# EAGLE design robot (EAGLE 6.1)

## Sheet 1 of 6
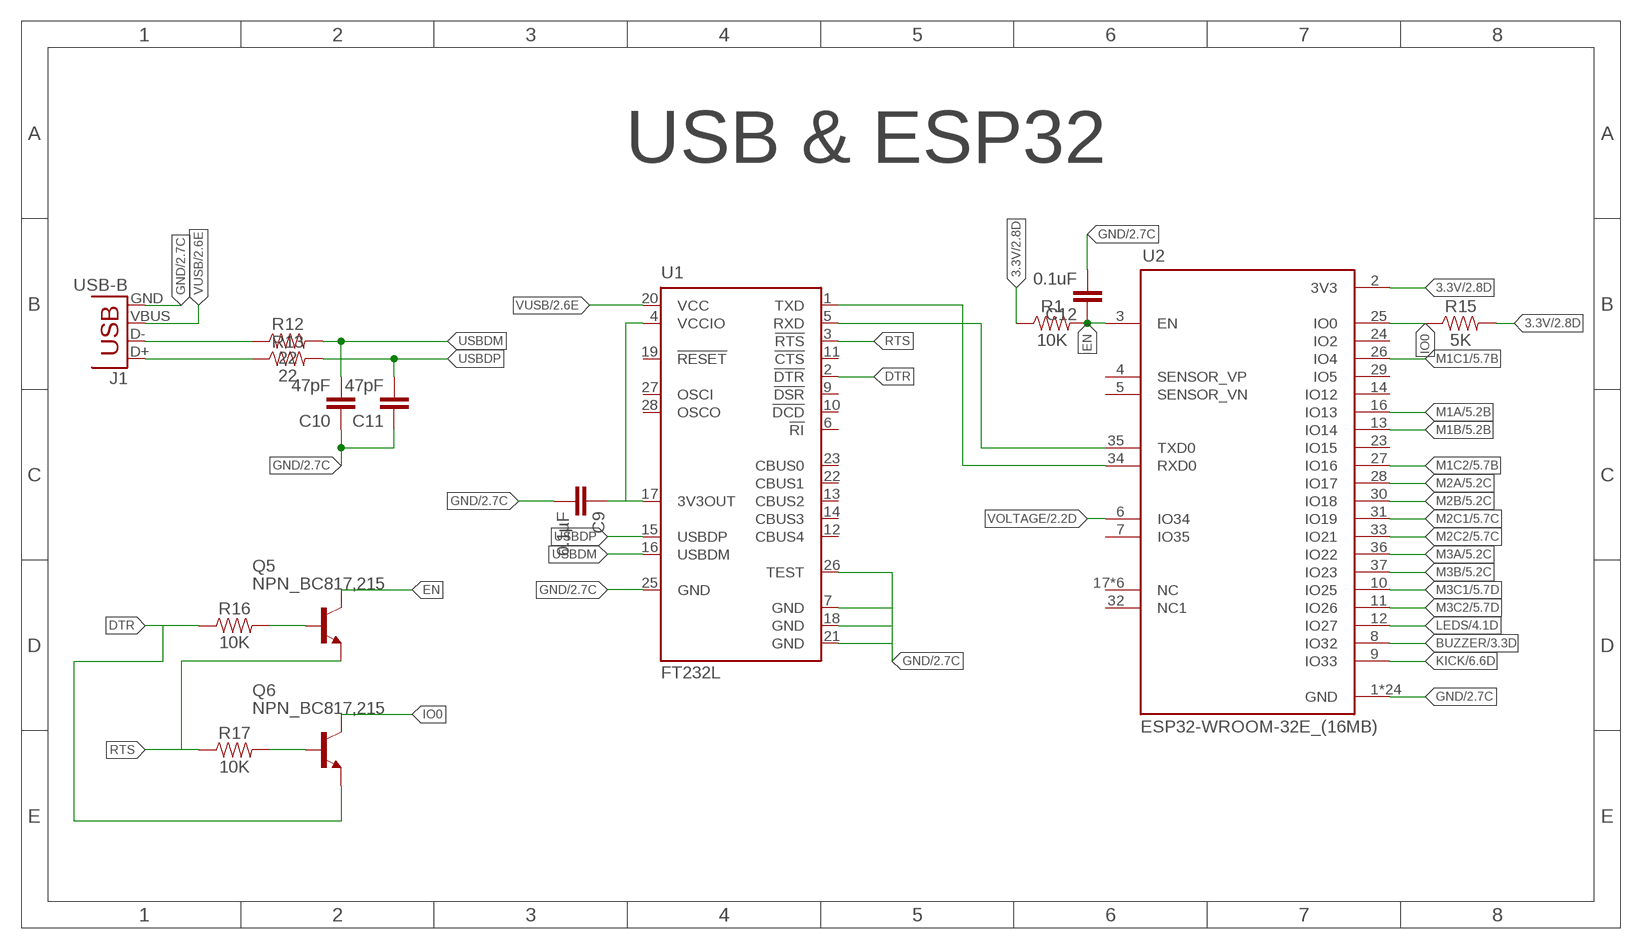
[diagram p0: schematic, sheet 1]

### Parts
C9  0.1µF  0.33UF/330NF-0805-50V-10%  [0805]
C10  47pF  CAP0805  [0805]
C11  47pF  CAP0805  [0805]
C12  0.1uF  CAP0805  [0805]
J1  USB-B  USBPTH  [USB-B-PTH]
Q5  NPN_BC817,215  [SOT-23]
Q6  NPN_BC817,215  [SOT-23]
R1  10K  0.3OHM-0805-1/8W-1%  [0805]
R12  22  0.3OHM-0805-1/8W-1%  [0805]
R13  22  0.3OHM-0805-1/8W-1%  [0805]
R15  5K  0.3OHM-0805-1/8W-1%  [0805]
R16  10K  0.3OHM-0805-1/8W-1%  [0805]
R17  10K  0.3OHM-0805-1/8W-1%  [0805]
U1  FT232L  [SSOP28]
U2  ESP32-WROOM-32E_(16MB)  [MODULE_ESP32-WROOM-32E_(16MB)]

### Nets
3.3V: R1.1 R15.2 U2.2(3V3) ; also sheet 2,3,5
BUZZER: U2.8(IO32) ; also sheet 3
DTR: Q6.2(E) R16.1 U1.2(!DTR)
EN: C12.1 Q5.3(C) R1.2 U2.3(EN)
GND [alime]: C9.2 C10.1 C11.1 C12.2 J1.GND U1.7(GND) U1.18(GND) U1.21(GND) U1.25(GND) U1.26(TEST) U2.1(GND) U2.15(GND) U2.38(GND) U2.39_1(GND) U2.39_2(GND) U2.39_3(GND) U2.39_4(GND) U2.39_5(GND) U2.39_6(GND) U2.39_7(GND) U2.39_8(GND) U2.39_9(GND) U2.39_10(GND) U2.39_11(GND) U2.39_12(GND) U2.39_13(GND) U2.39_14(GND) U2.39_15(GND) U2.39_16(GND) U2.39_17(GND) U2.39_18(GND) U2.39_19(GND) U2.39_20(GND) U2.39_21(GND) ; also sheet 2,3,4,5,6
IO0: Q6.3(C) R15.1 U2.25(IO0)
KICK: U2.9(IO33) ; also sheet 6
LEDS: U2.12(IO27) ; also sheet 4
M1A: U2.16(IO13) ; also sheet 5
M1B: U2.13(IO14) ; also sheet 5
M1C1: U2.26(IO4) ; also sheet 5
M1C2: U2.27(IO16) ; also sheet 5
M2A: U2.28(IO17) ; also sheet 5
M2B: U2.30(IO18) ; also sheet 5
M2C1: U2.31(IO19) ; also sheet 5
M2C2: U2.33(IO21) ; also sheet 5
M3A: U2.36(IO22) ; also sheet 5
M3B: U2.37(IO23) ; also sheet 5
M3C1: U2.10(IO25) ; also sheet 5
M3C2: U2.11(IO26) ; also sheet 5
N$6: U1.1(TXD) U2.34(RXD0)
N$14: U1.5(RXD) U2.35(TXD0)
N$15: C9.1 U1.4(VCCIO) U1.17(3V3OUT)
N$16: Q5.1(B) R16.2
N$17: Q6.1(B) R17.2
N$59: J1.D- R12.1
N$60: J1.D+ R13.1
RTS: Q5.2(E) R17.1 U1.3(!RTS)
USBDM: C10.2 R12.2 U1.16(USBDM)
USBDP: C11.2 R13.2 U1.15(USBDP)
VOLTAGE: U2.6(IO34) ; also sheet 2
VUSB [alime]: J1.VBUS U1.20(VCC) ; also sheet 2
Unconnected: U1.6(!RI) U1.9(!DSR) U1.10(!DCD) U1.11(!CTS) U1.12(CBUS4) U1.13(CBUS2) U1.14(CBUS3) U1.19(!RESET) U1.22(CBUS1) U1.23(CBUS0) U1.27(OSCI) U1.28(OSCO) U2.4(SENSOR_VP) U2.5(SENSOR_VN) U2.7(IO35) U2.14(IO12) U2.17(NC) U2.18(NC) U2.19(NC) U2.20(NC) U2.21(NC) U2.22(NC) U2.23(IO15) U2.24(IO2) U2.29(IO5) U2.32(NC1)

### Notes on the sheet
- USB & ESP32

## Sheet 2 of 6
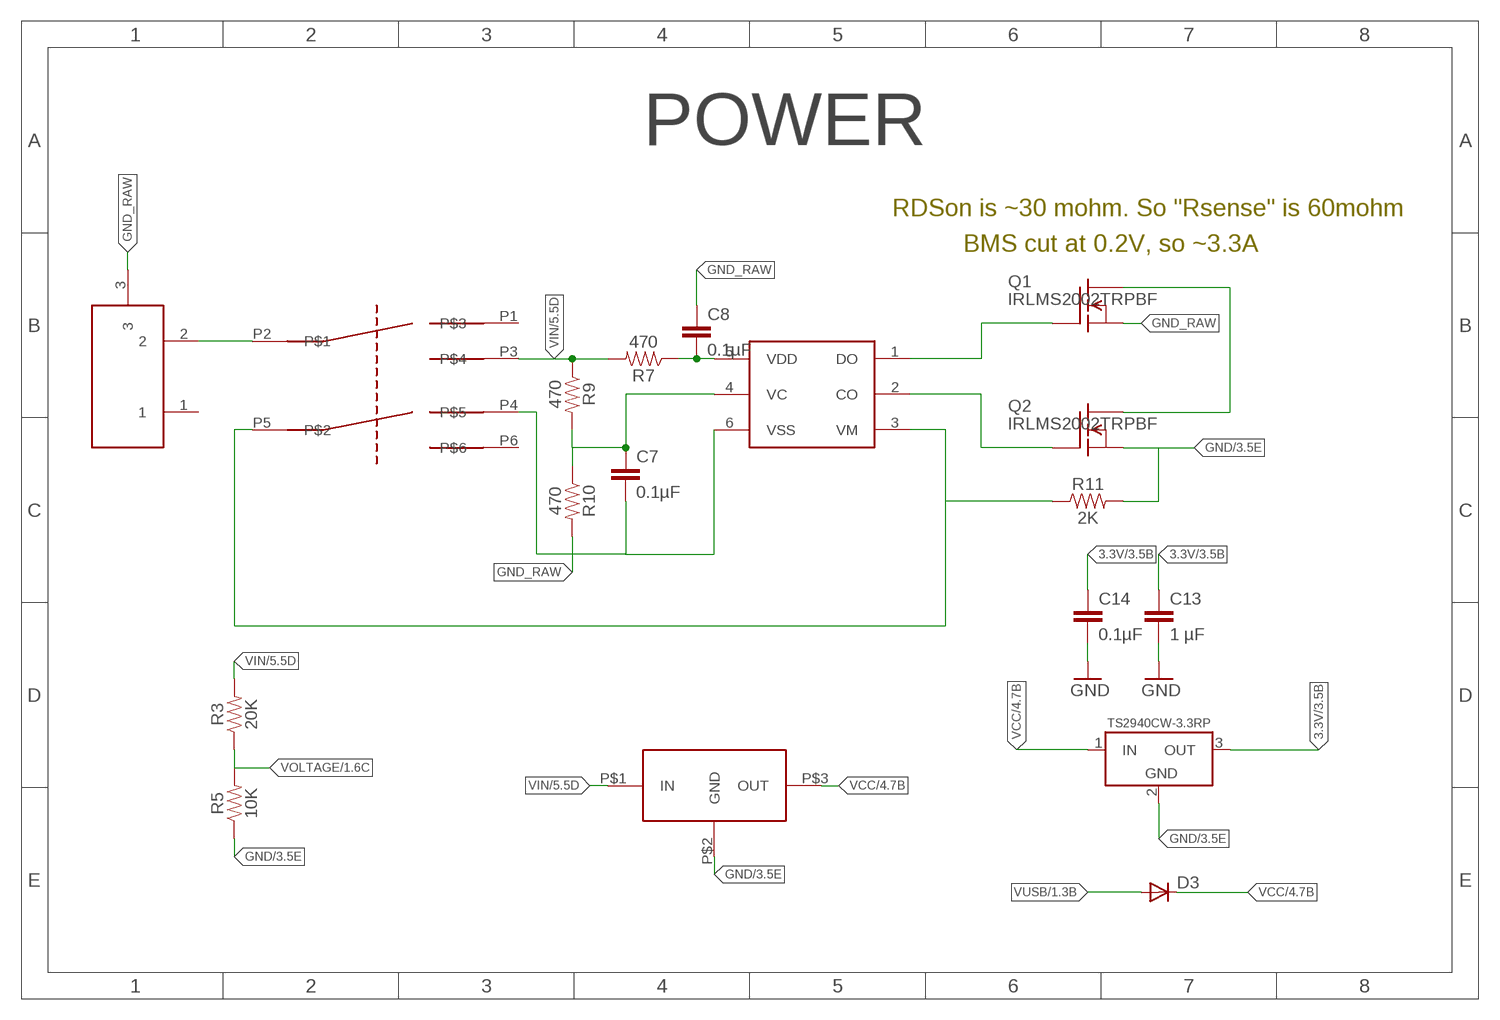
[diagram p1: schematic, sheet 2]

### Parts
C7  0.1µF  0.33UF/330NF-0805-50V-10%  [0805]
C8  0.1µF  0.33UF/330NF-0805-50V-10%  [0805]
C13  1 µF  0.33UF/330NF-0805-50V-10%  [0805]
C14  0.1µF  0.33UF/330NF-0805-50V-10%  [0805]
D3  DIODESOD  [SOD-323]
J2  DC21MMX  [DC-21MM]
Q1  IRLMS2002TRPBF  [SOT23-6]
Q2  IRLMS2002TRPBF  [SOT23-6]
R3  20K  0.3OHM-0805-1/8W-1%  [0805]
R5  10K  0.3OHM-0805-1/8W-1%  [0805]
R7  470  0.3OHM-0805-1/8W-1%  [0805]
R9  470  0.3OHM-0805-1/8W-1%  [0805]
R10  470  0.3OHM-0805-1/8W-1%  [0805]
R11  2K  0.3OHM-0805-1/8W-1%  [0805]
REG1  REG_5V  [TRACOPOWER]
S1  DPDT  [L202021MA04Q]
U3  S8252  [SOT23-6]
U$25  TS2940CW-3.3RP  [SOT223]

### Nets
3.3V: C13.1 C14.1 U$25.3(OUT) ; also sheet 1,3,5
GND [alime]: C13.2 C14.2 Q2.4(S) R5.1 R11.2 REG1.P$2(GND) U$25.2(GND) ; also sheet 1,3,4,5,6
GND_RAW [alime]: C7.2 C8.1 J2.3 Q1.4(S) R10.2 S1.P4 U3.6(VSS)
N$7 [alime]: J2.2 S1.P2
N$8: C8.2 R7.1 U3.5(VDD)
N$9: C7.1 R9.2 R10.1 U3.4(VC)
N$10: Q1.1(D) Q1.2(D) Q1.5(D) Q1.6(D) Q2.1(D) Q2.2(D) Q2.5(D) Q2.6(D)
N$11: Q2.3(G) U3.2(CO)
N$12: Q1.3(G) U3.1(DO)
N$13: R11.1 S1.P5 U3.3(VM)
VCC [alime]: D3.1(C) REG1.P$3(OUT) U$25.1(IN) ; also sheet 4
VIN [alime]: R3.2 R7.2 R9.1 REG1.P$1(IN) S1.P3 ; also sheet 5,6
VOLTAGE: R3.1 R5.2 ; also sheet 1
VUSB [alime]: D3.2(A) ; also sheet 1
Unconnected: S1.P1 S1.P6

### Notes on the sheet
- POWER
- RDSon is ~30 mohm. So "Rsense" is 60mohm
- BMS cut at 0.2V, so ~3.3A

## Sheet 3 of 6
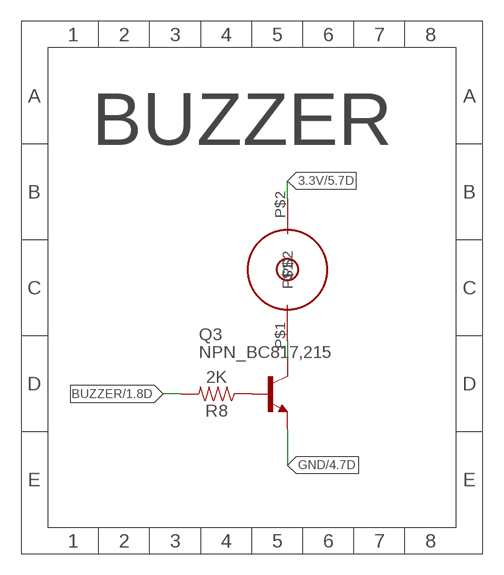
[diagram p2: schematic, sheet 3]

### Parts
B1  BUZZER66  [BUZZER66]
Q3  NPN_BC817,215  [SOT-23]
R8  2K  0.3OHM-0805-1/8W-1%  [0805]

### Nets
3.3V: B1.P$2 ; also sheet 1,2,5
BUZZER: R8.2 ; also sheet 1
GND [alime]: Q3.2(E) ; also sheet 1,2,4,5,6
N$3: Q3.1(B) R8.1
N$5: B1.P$1 Q3.3(C)

### Notes on the sheet
- BUZZER

## Sheet 4 of 6
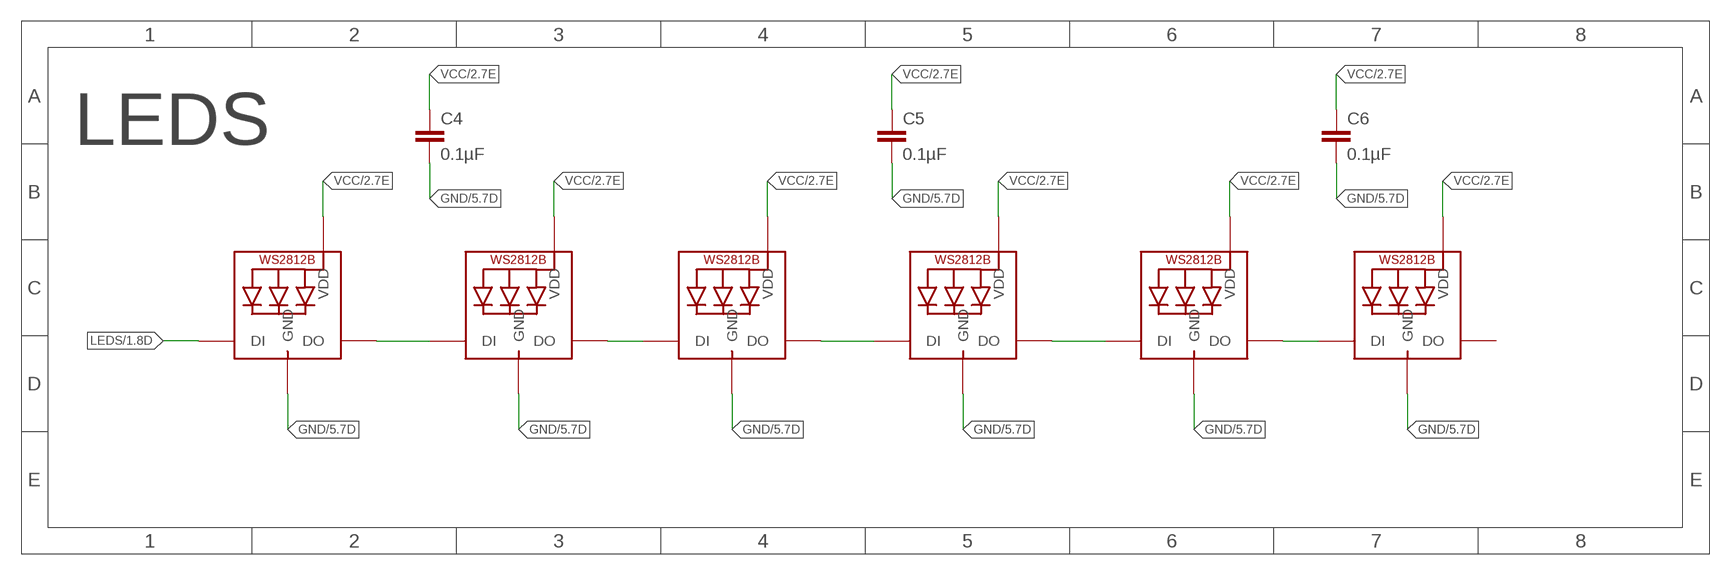
[diagram p3: schematic, sheet 4]

### Parts
C4  0.1µF  0.33UF/330NF-0805-50V-10%  [0805]
C5  0.1µF  0.33UF/330NF-0805-50V-10%  [0805]
C6  0.1µF  0.33UF/330NF-0805-50V-10%  [0805]
LED1  WS2812B5050  [WS2812B]
LED2  WS2812B5050  [WS2812B]
LED3  WS2812B5050  [WS2812B]
LED4  WS2812B5050  [WS2812B]
LED5  WS2812B5050  [WS2812B]
LED6  WS2812B5050  [WS2812B]

### Nets
GND [alime]: C4.2 C5.2 C6.2 LED1.3-GND(GND) LED2.3-GND(GND) LED3.3-GND(GND) LED4.3-GND(GND) LED5.3-GND(GND) LED6.3-GND(GND) ; also sheet 1,2,3,5,6
LEDS: LED1.4-DIN(DI) ; also sheet 1
N$27: LED1.2-DOUT(DO) LED2.4-DIN(DI)
N$28: LED2.2-DOUT(DO) LED3.4-DIN(DI)
N$30: LED4.2-DOUT(DO) LED5.4-DIN(DI)
N$32: LED5.2-DOUT(DO) LED6.4-DIN(DI)
N$39: LED3.2-DOUT(DO) LED4.4-DIN(DI)
VCC [alime]: C4.1 C5.1 C6.1 LED1.1-VDD(VDD) LED2.1-VDD(VDD) LED3.1-VDD(VDD) LED4.1-VDD(VDD) LED5.1-VDD(VDD) LED6.1-VDD(VDD) ; also sheet 2
Unconnected: LED6.2-DOUT(DO)

### Notes on the sheet
- LEDS

## Sheet 5 of 6
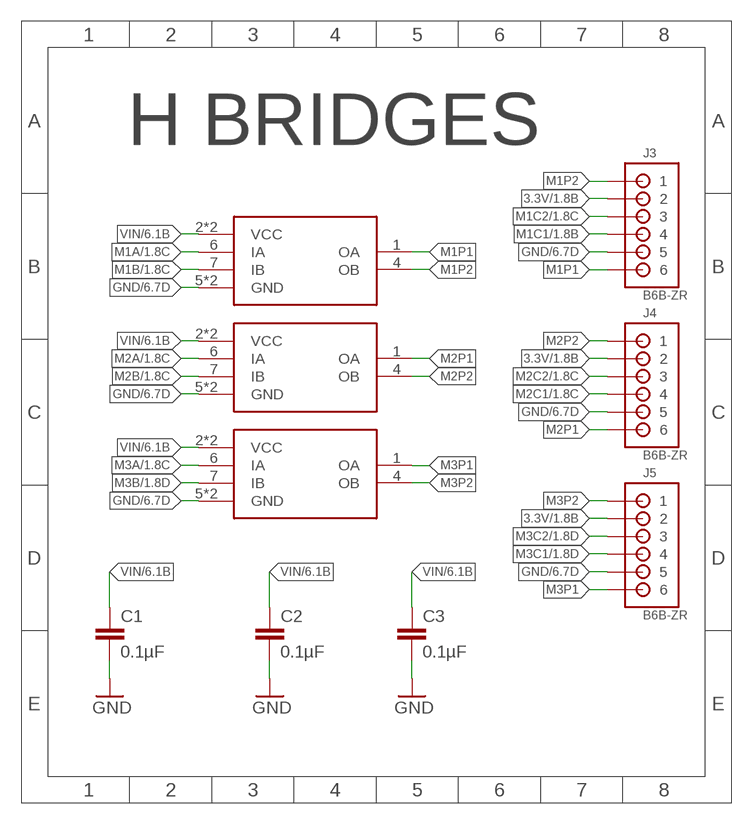
[diagram p4: schematic, sheet 5]

### Parts
C1  0.1µF  0.33UF/330NF-0805-50V-10%  [0805]
C2  0.1µF  0.33UF/330NF-0805-50V-10%  [0805]
C3  0.1µF  0.33UF/330NF-0805-50V-10%  [0805]
J3  B6B-ZR  [B6B-ZR]
J4  B6B-ZR  [B6B-ZR]
J5  B6B-ZR  [B6B-ZR]
U4  L9110  [SO8]
U5  L9110  [SO8]
U6  L9110  [SO8]

### Nets
3.3V: J3.2 J4.2 J5.2 ; also sheet 1,2,3
GND [alime]: C1.2 C2.2 C3.2 J3.5 J4.5 J5.5 U4.5(GND) U4.8(GND) U5.5(GND) U5.8(GND) U6.5(GND) U6.8(GND) ; also sheet 1,2,3,4,6
M1A: U4.6(IA) ; also sheet 1
M1B: U4.7(IB) ; also sheet 1
M1C1: J3.4 ; also sheet 1
M1C2: J3.3 ; also sheet 1
M1P1 [alime]: J3.6 U4.1(OA)
M1P2 [alime]: J3.1 U4.4(OB)
M2A: U5.6(IA) ; also sheet 1
M2B: U5.7(IB) ; also sheet 1
M2C1: J4.4 ; also sheet 1
M2C2: J4.3 ; also sheet 1
M2P1 [alime]: J4.6 U5.1(OA)
M2P2 [alime]: J4.1 U5.4(OB)
M3A: U6.6(IA) ; also sheet 1
M3B: U6.7(IB) ; also sheet 1
M3C1: J5.4 ; also sheet 1
M3C2: J5.3 ; also sheet 1
M3P1 [alime]: J5.6 U6.1(OA)
M3P2 [alime]: J5.1 U6.4(OB)
VIN [alime]: C1.1 C2.1 C3.1 U4.2(VCC) U4.3(VCC) U5.2(VCC) U5.3(VCC) U6.2(VCC) U6.3(VCC) ; also sheet 2,6

### Notes on the sheet
- H BRIDGES

## Sheet 6 of 6
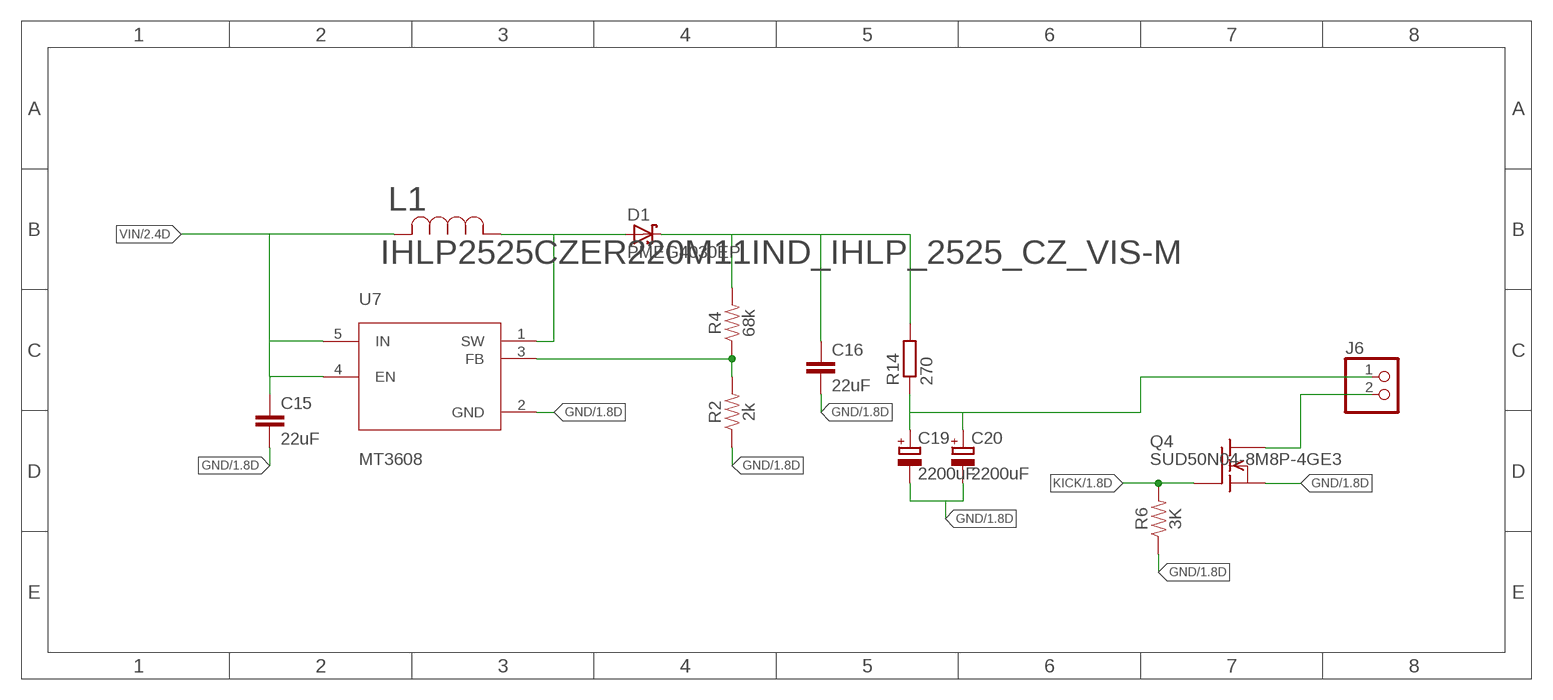
[diagram p5: schematic, sheet 6]

### Parts
C15  22uF  C-EUC0805  [C0805]
C16  22uF  C-EUC0805  [C0805]
C19  2200uF  CPOL-EUE5-13  [E5-13]
C20  2200uF  CPOL-EUE5-13  [E5-13]
D1  PMEG4030EP  [SOD128]
J6  KICKER  [KICKER]
L1  IHLP2525CZER220M11IND_IHLP_2525_CZ_VIS-M  [IND_IHLP_2525_CZ_VIS-M]
Q4  SUD50N04-8M8P-4GE3  [TO252]
R2  2k  0.3OHM-0805-1/8W-1%  [0805]
R4  68k  0.3OHM-0805-1/8W-1%  [0805]
R6  3K  0.3OHM-0805-1/8W-1%  [0805]
R14  270  R-EU_R2010  [R2010]
U7  MT3608  [SOT95P280X145-6N]

### Nets
GND [alime]: C15.2 C16.2 C19.- C20.- Q4.2(S) R2.1 R6.1 U7.2(GND) ; also sheet 1,2,3,4,5
KICK: Q4.1(G) R6.2 ; also sheet 1
KICKER: J6.2 Q4.3(D)
N$1: D1.2(A) L1.1 U7.1(SW)
N$2: C16.1 D1.1(K) R4.2 R14.2
N$4: R2.2 R4.1 U7.3(FB)
VIN [alime]: C15.1 L1.2 U7.4(EN) U7.5(IN) ; also sheet 2,5
VSTORE: C19.+ C20.+ J6.1 R14.1

## Power pins joined to a net without a drawn wire
1: J2.1

## Library data of the parts
B1 = rhoban:BUZZER; FARNELL: CEM-1203
C1-C9 C13 C14 = SparkFun-Capacitors:0.33UF/330NF: 0.33µF/330nF ceramic capacitors A capacitor is a passive two-terminal electrical component used to store electrical energy temporarily in an electric field.; FARNELL: 2688486RL; PROD_ID: CAP-08469; VALUE: 0.33µF
C10-C12 = SparkFun-Passives:CAP: Capacitor Standard 0603 ceramic capacitor, and 0.1" leaded capacitor.; FARNELL: 1081223
C15 C16 = resistor:C-EU: CAPACITOR, European symbol; FARNELL: 2666560
C19 C20 = rcl:CPOL-EU: POLARIZED CAPACITOR, European symbol; FARNELL: 2749341
D1 = nxp_60:PMEG4030E: 40 V, 3 A low VF MEGA Schottky barrier rectifier Planar Maximum Efficiency General Application (MEGA) Schottky barrier rectifier with an integrated guard ring for stress protection. AAL Eindhoven MK; FARNELL: 1829201
D3 = SparkFun-DiscreteSemi:DIODE: Diode These are standard reverse protection diodes and small signal diodes. SMA package can handle up to about 1A. SOD-323 can handle about 200mA. What the SOD-323 package when ordering, there are some mfgs out there that are 5-pin packages.; FARNELL: 8737843RL
J1 = SparkFun-Connectors:USB: USB Connectors USB-B-PTH is fully proven SKU : PRT-00139/CONN-08278 USB-miniB is fully proven SKU : PRT-00587 USB-A-PCB is untested. USB-A-H is throughly reviewed, but untested. Spark Fun Electronics SKU : PRT-00437 USB-B-SMT is throughly reviewed, but untested. Needs silkscreen touching up. USB-A-S has not been used/tested USB-MB-H has not been used/tested USB-MICROB has been used. CONN-09505; FARNELL: 1308876; PROD_ID: CONN-08278
J2 = powersupply:DC21MM; FARNELL: 1217037
J3-J5 = jst:B6B-ZR: JST-ZH Connector 6 pol, 1.5mm pitch Package: B6B-ZR Source: http://www.jst-mfg.com/product/pdf/eng/eZH.pdf; FARNELL: 9491805
J6 = rhoban:KICKER; FARNELL: JF-0530B
L1 = INDUCTOR:IHLP2525CZER220M11; BUILT_BY: EMA_UL_Team; FARNELL: 1741369; MANUFACTURER_PART_NUMBER: IHLP2525CZER220M11; SOURCELIBRARY: Vishay_2020-02-10; VENDOR: Vishay
LED1-LED6 = adafruit:WS2812B; FARNELL: WS2812B 5050
Q1 Q2 = rhoban:IRLMS2002TRPBF; FARNELL: 2577180RL
Q3 Q5 Q6 = rhoban:NPN; FARNELL: 1081223
Q4 = rhoban:SUD50N04-8M8P-4GE3; FARNELL: 1794799
R1 R12 R13 R15-R17 = SparkFun-Resistors:0.3OHM: 0.3Ω resistor A resistor is a passive two-terminal electrical component that implements electrical resistance as a circuit element. Resistors act to reduce current flow, and, at the same time, act to lower voltage levels within circuits. - Wikipedia; FARNELL: 2446926; PROD_ID: RES-11622; VALUE: 0.3
R2 R8 R11 = SparkFun-Resistors:0.3OHM: 0.3Ω resistor A resistor is a passive two-terminal electrical component that implements electrical resistance as a circuit element. Resistors act to reduce current flow, and, at the same time, act to lower voltage levels within circuits. - Wikipedia; FARNELL: 2447622; PROD_ID: RES-11622; VALUE: 0.3
R3 = SparkFun-Resistors:0.3OHM: 0.3Ω resistor A resistor is a passive two-terminal electrical component that implements electrical resistance as a circuit element. Resistors act to reduce current flow, and, at the same time, act to lower voltage levels within circuits. - Wikipedia; FARNELL: 2074395; PROD_ID: RES-11622; VALUE: 0.3
R4 = SparkFun-Resistors:0.3OHM: 0.3Ω resistor A resistor is a passive two-terminal electrical component that implements electrical resistance as a circuit element. Resistors act to reduce current flow, and, at the same time, act to lower voltage levels within circuits. - Wikipedia; FARNELL: 2447023; PROD_ID: RES-11622; VALUE: 0.3
R5 R9 R10 = SparkFun-Resistors:0.3OHM: 0.3Ω resistor A resistor is a passive two-terminal electrical component that implements electrical resistance as a circuit element. Resistors act to reduce current flow, and, at the same time, act to lower voltage levels within circuits. - Wikipedia; FARNELL: 2074334RL; PROD_ID: RES-11622; VALUE: 0.3
R6 = SparkFun-Resistors:0.3OHM: 0.3Ω resistor A resistor is a passive two-terminal electrical component that implements electrical resistance as a circuit element. Resistors act to reduce current flow, and, at the same time, act to lower voltage levels within circuits. - Wikipedia; FARNELL: 1887603; PROD_ID: RES-11622; VALUE: 0.3
R7 = SparkFun-Resistors:0.3OHM: 0.3Ω resistor A resistor is a passive two-terminal electrical component that implements electrical resistance as a circuit element. Resistors act to reduce current flow, and, at the same time, act to lower voltage levels within circuits. - Wikipedia; FARNELL: 2447662; PROD_ID: RES-11622; VALUE: 0.3
R14 = rcl:R-EU_: RESISTOR, European symbol; FARNELL: 1887603
REG1 = rhoban:REG_5V; FARNELL: 1696320
S1 = rhoban:DPDT; FARNELL: 2435159
U1 = rhoban:FT232: Source: http://www.ftdichip.com/Documents/DataSheets/DS_FT232R_v104.pdf; DATASHEET: ft232rl.pdf; FARNELL: 1146032; FARNELL_LINK: http://fr.farnell.com/ftdi/ft232rl/usb-vers-uart-cms-ssop28-232/dp/1146032?Ntt=1146032; MPN: FT232RL; OC_FARNELL: 1146032; OC_NEWARK: 91K9918
U2 = ESP32-WROOM-32E__16MB_:ESP32-WROOM-32E_(16MB): Bluetooth, WiFi 802.11b/g/n, Bluetooth v4.2 +EDR, Class 1, 2 and 3 Transceiver Module 2.4GHz ~ 2.5GHz Integrated, Trace Surface Mount Check availability; AVAILABILITY: In Stock; DESCRIPTION: Bluetooth, WiFi 802.11b/g/n, Bluetooth v4.2 +EDR, Class 1, 2 and 3 Transceiver Module 2.4GHz ~ 2.5GHz Integrated, Trace Surface Mount; FARNELL: ESP32-WROOM; MF: Espressif Systems; MP: ESP32-WROOM-32E (16MB); PACKAGE: SMD-44 Espressif Systems; PRICE: None
U3 = rhoban:S8252; FARNELL: https://www.digikey.fr/fr/products/detail/ablic-u-s-a-inc/S-8252AAL-M6T1U/6121452; REF: S-8252AAL-M6T1U
U4-U6 = rhoban:L9110; FARNELL: L9110 SOIC8
U7 = MT3608:MT3608: High Efficiency 1.2MHz 2A Step Up Converter Check prices; AVAILABILITY: No availability data; DESCRIPTION: High Efficiency 1.2MHz 2A Step Up Converter; FARNELL: MT3608; MF: Aerosemi Technology Co., Ltd; MP: MT3608; PACKAGE: Package; PRICE: None
U$25 = rhoban:TS2940CW-3.3RP; FARNELL: 7261403

## Net classes
0 default: width 0.203 mm
1 alime: width 0.508 mm
2 bigalime: width 0.381 mm

## Board
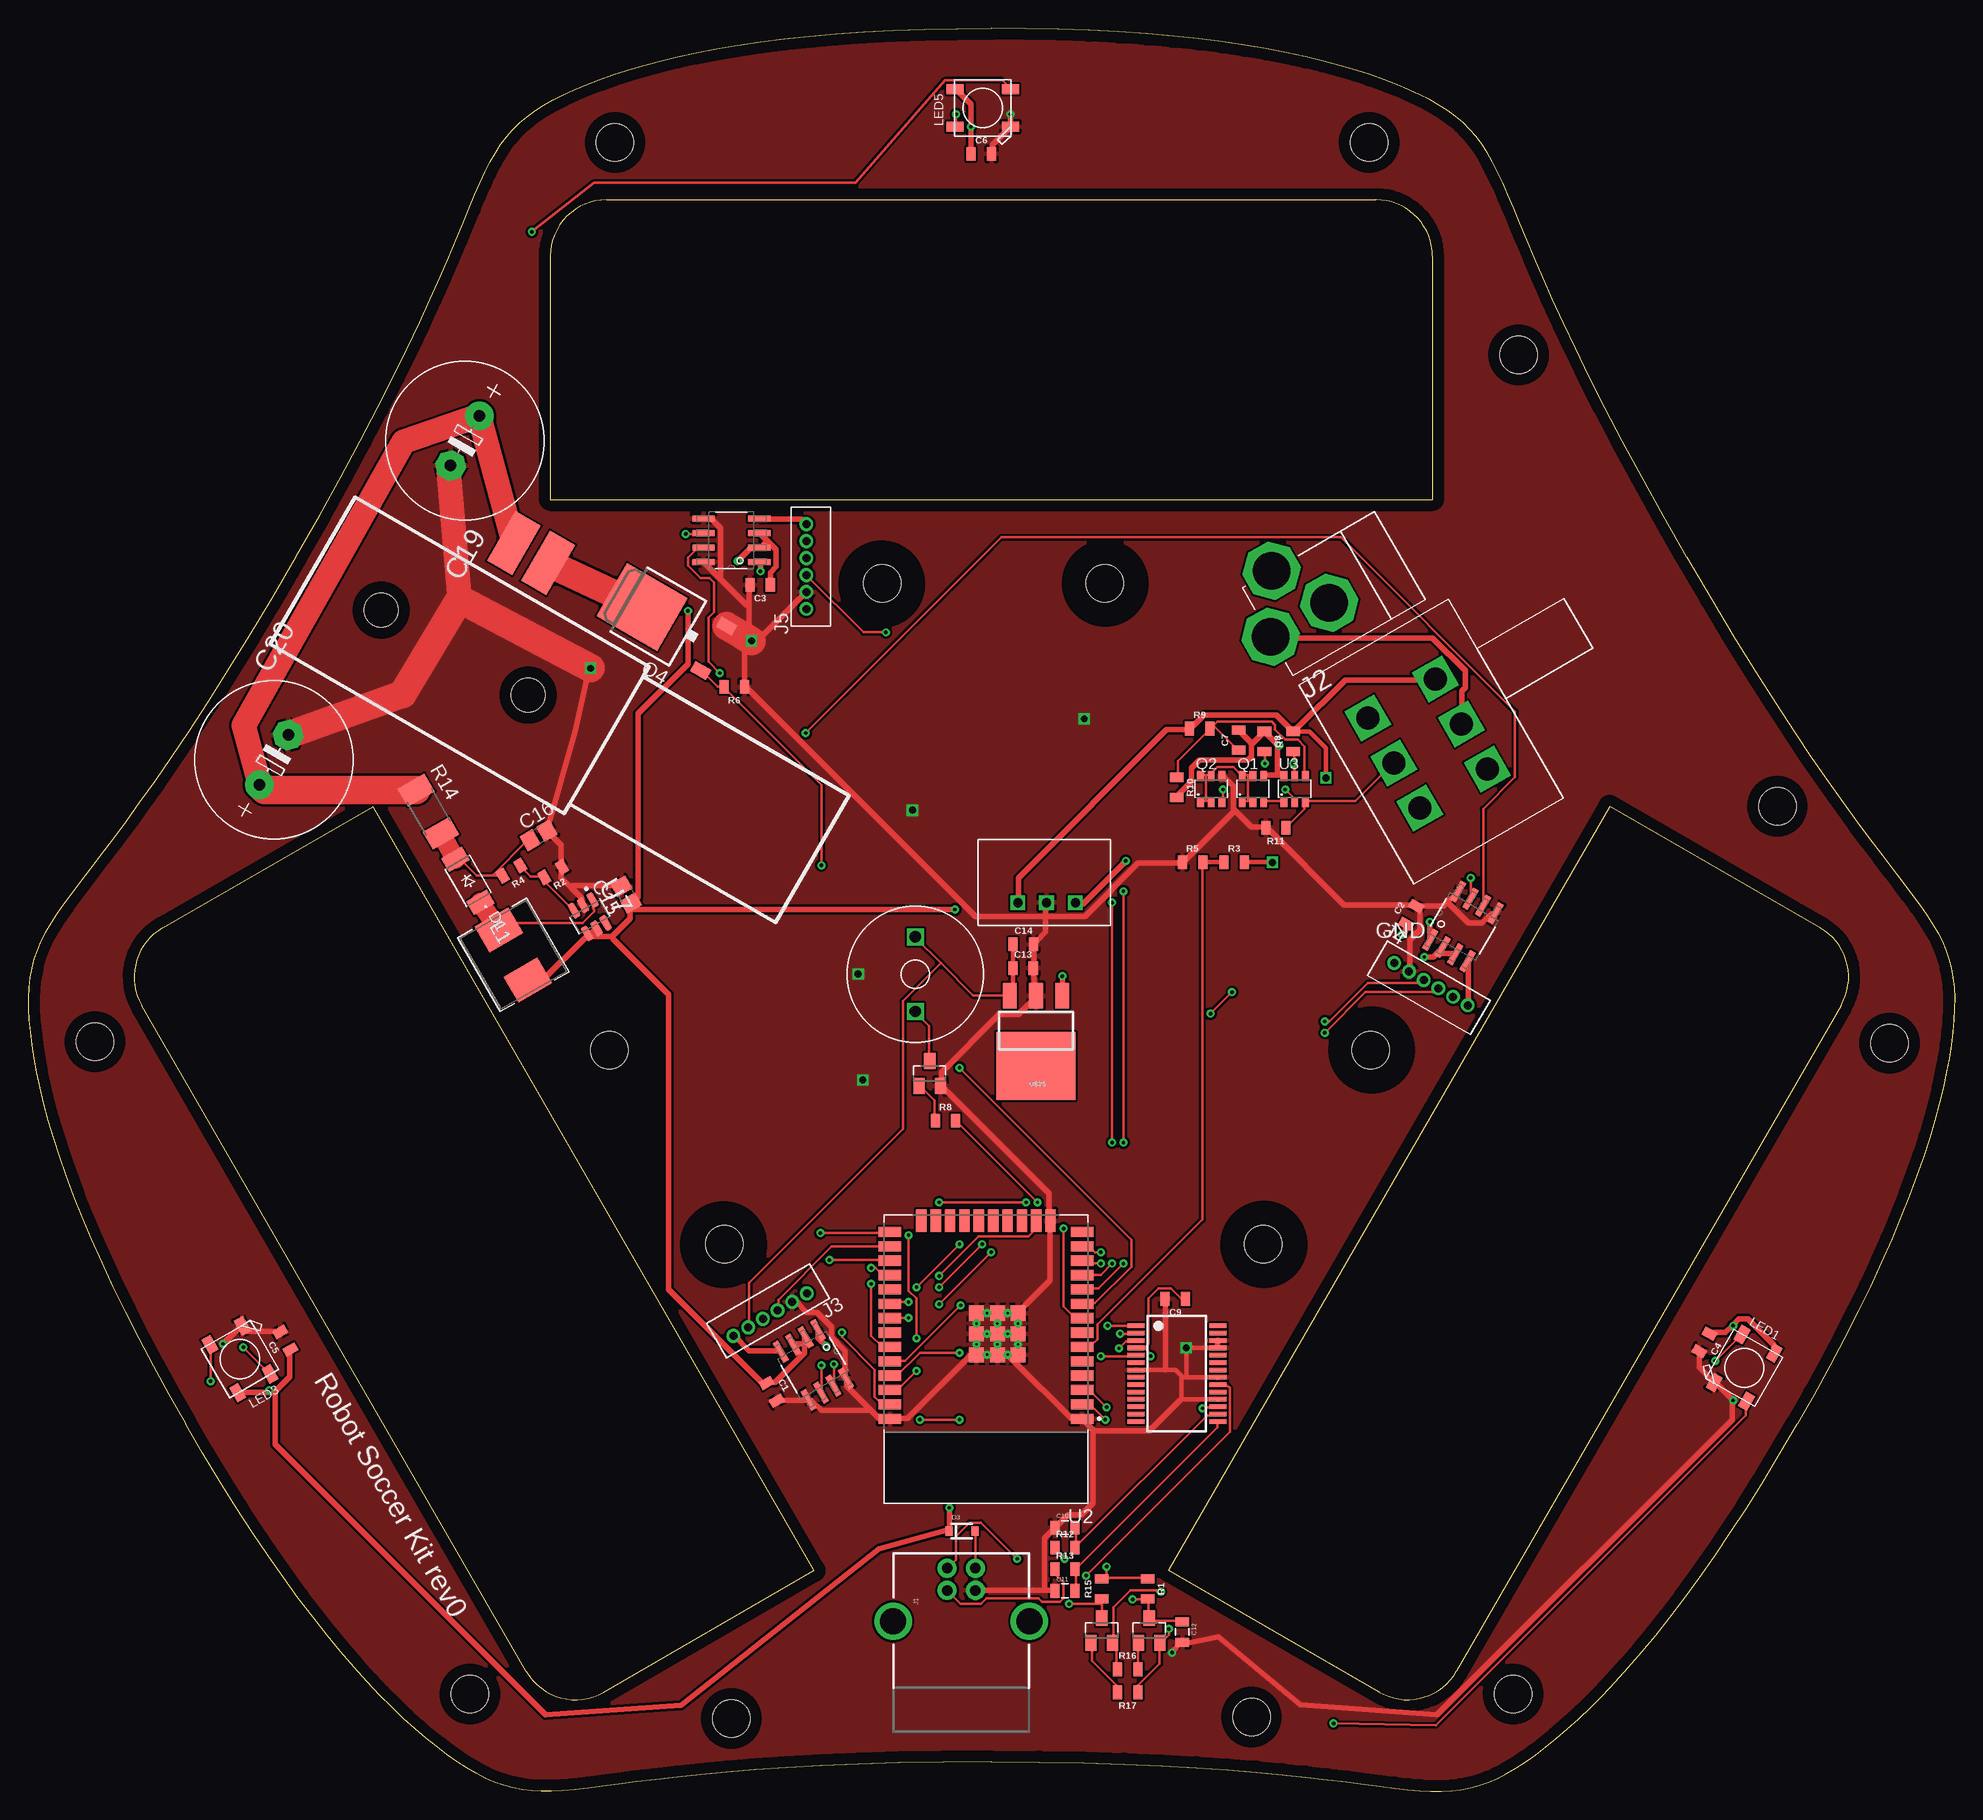
[diagram p6: board, top side]
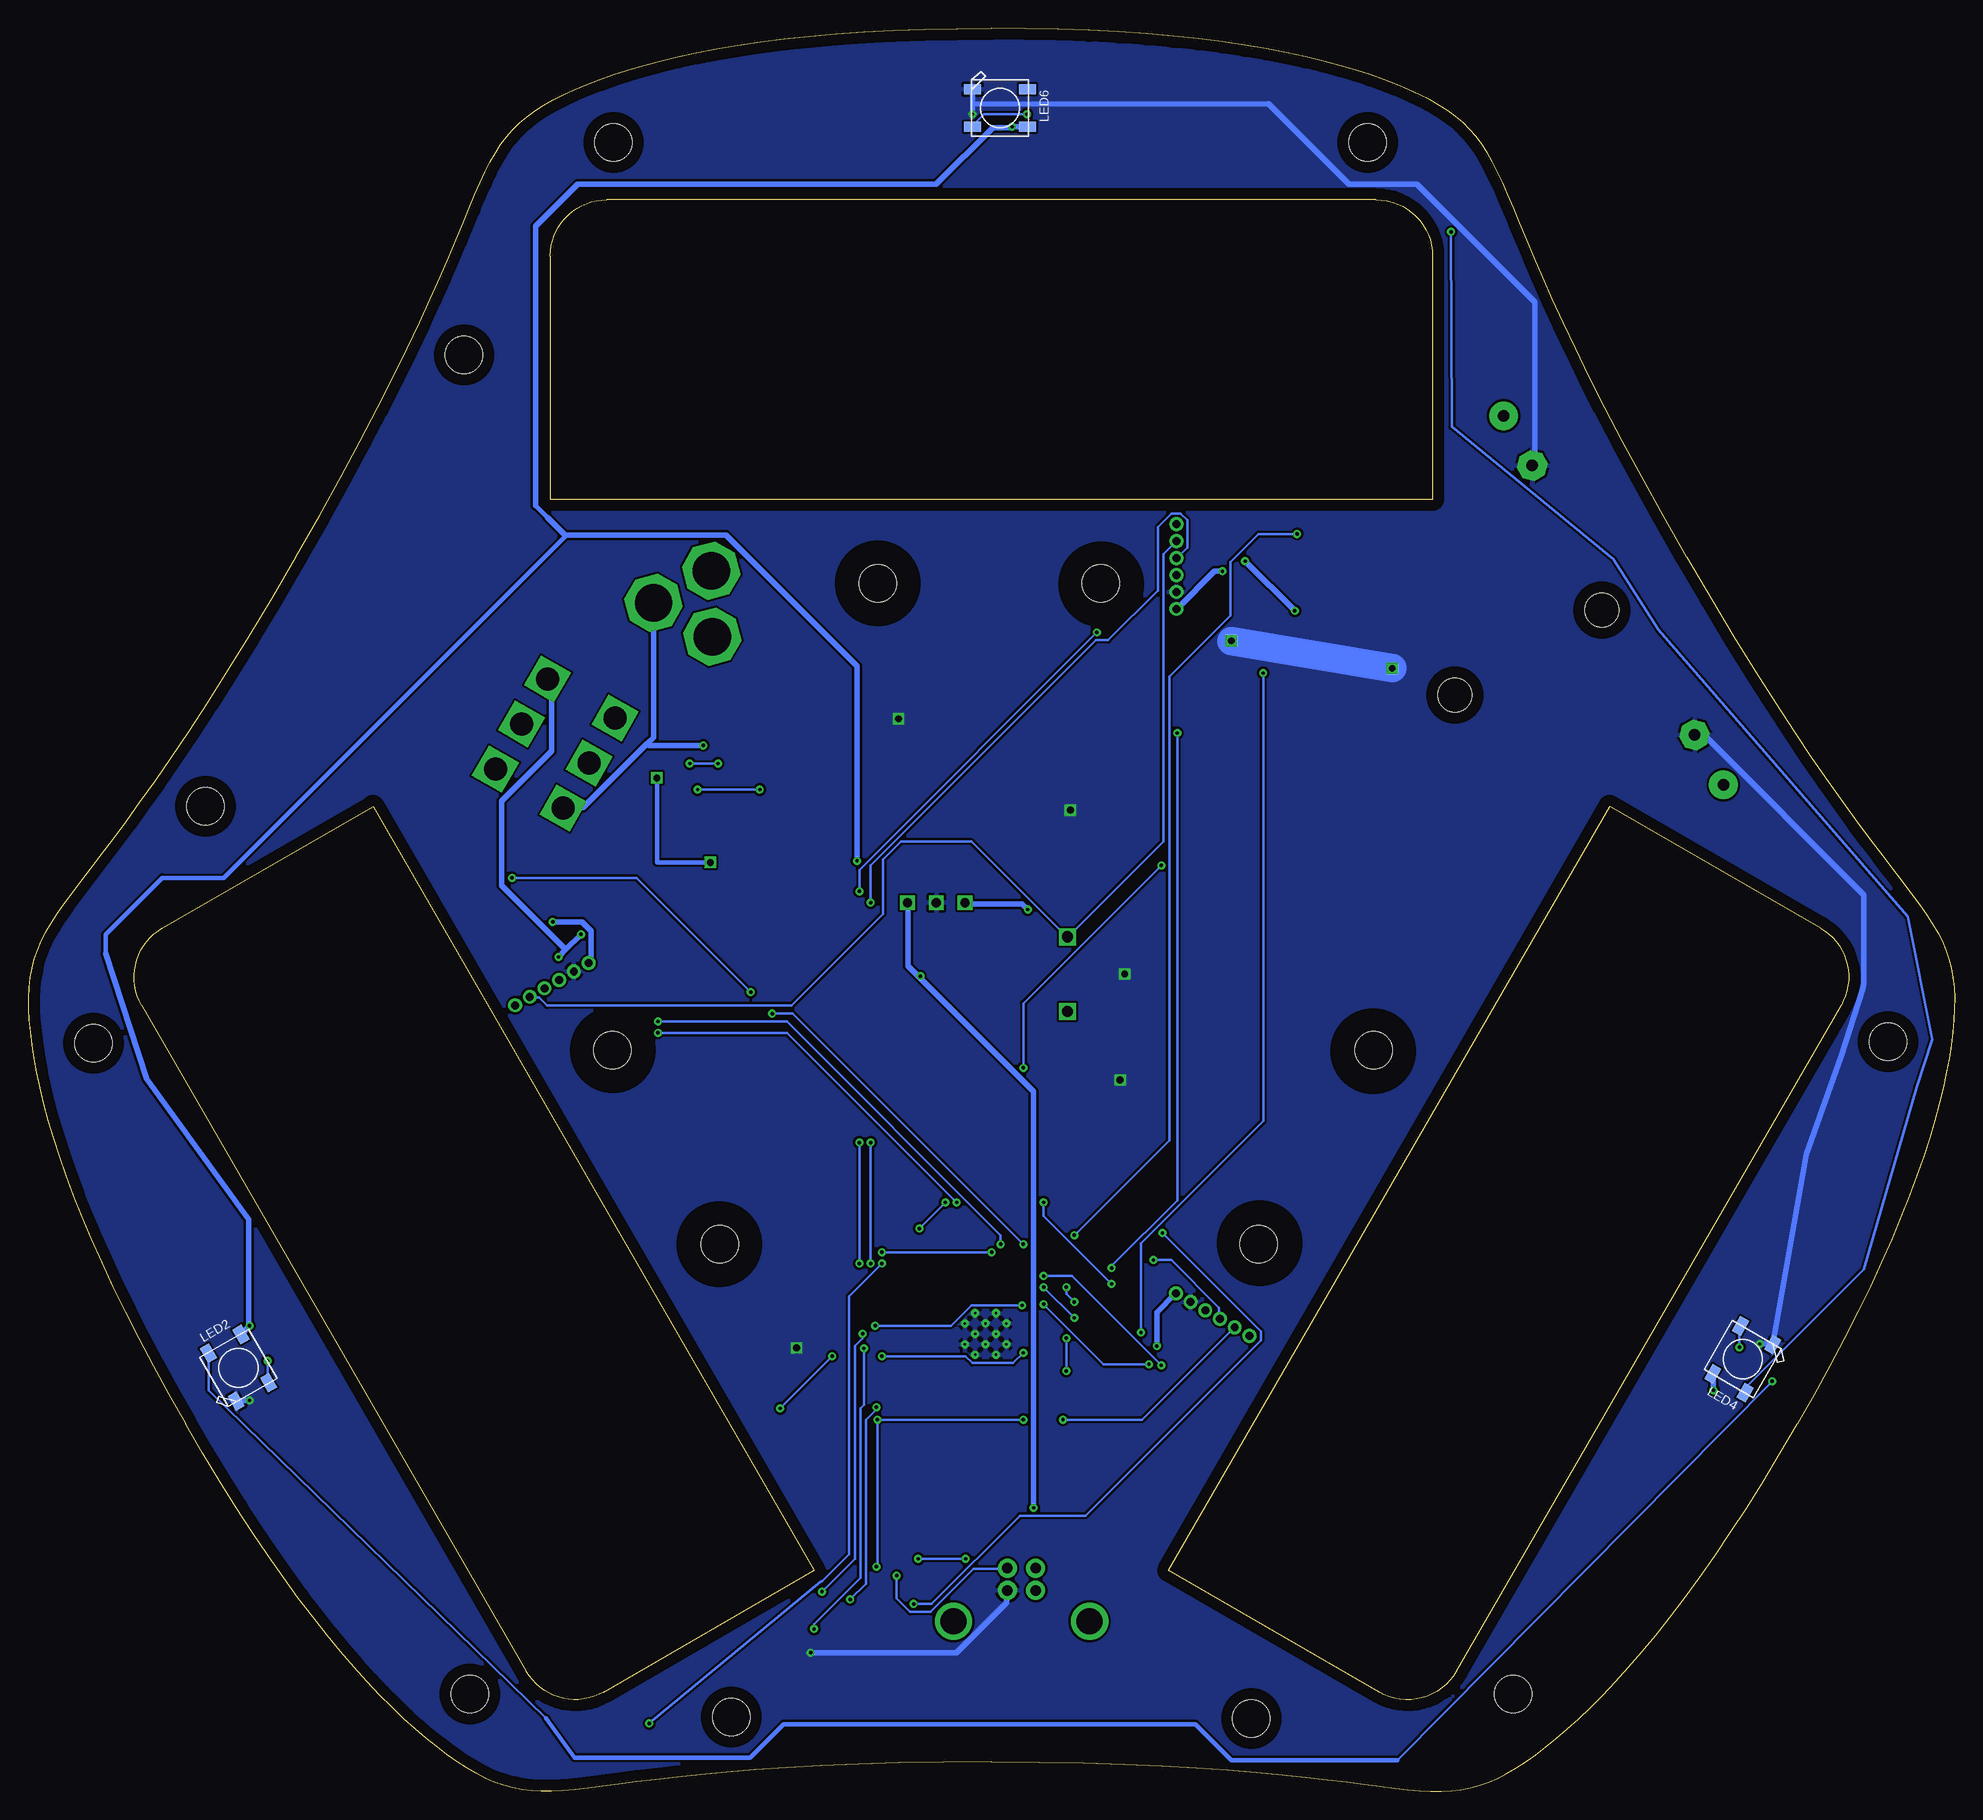
[diagram p7: board, bottom side, seen from below]

Size 170.28 x 155.86 mm. Coordinates in mm from the lower left corner, seen from the top.
Outline: 300 segments
Copper layers (1*16): Top 0.035mm / dielectric 1.5mm / Bottom 0.035mm
Design rules: minimum track width 6mil, minimum drill 0.3mm, track to track 0.205mm, track to pad 0.205mm, pad to pad 0.205mm, via to via 0.205mm, smd to smd 8mil, copper to edge 40mil, drill to drill 8mil, minimum pad ring 10mil, minimum via ring 8mil, stop-mask expansion 4mil, vias tented up to drill 25mil, thermal gap 10mil
tRestrict: area 47.6,61.6 to 55.2,69.2; area 57.6,44.5 to 65.3,52.2; area 114.9,61.7 to 122.6,69.4; area 105.4,44.5 to 113.1,52.2; area 71.6,102.9 to 79.3,110.6; area 91.4,103 to 99,110.6
bRestrict: area 47.6,61.6 to 55.2,69.2; area 57.7,44.7 to 65.2,52.2; area 114.8,61.8 to 122.4,69.3; area 105.4,44.6 to 113,52.1; area 71.6,102.9 to 79.2,110.5; area 91.4,103 to 98.9,110.6

### Footprints (pad centres in the part's own frame; a part is rotated, then mirrored left to right if it is on the bottom)
BUZZER66 = drill 1 square: P$1 -3.3,0; P$2 3.3,0
0805 = smd 0.8 x 1.2: 1 -0.9,0; 2 0.9,0
C0805 = smd 1.3 x 1.5: 1 -0.85,0; 2 0.85,0
E5-13 = drill 1.016 pad 2.54: + -2.54,0 | drill 1.016 pad 2.54 octagon: - 2.54,0
SOD128 = smd 1.4 x 2.1: 1 -2.2,0; 2 2.2,0
SOD-323 = smd 0.63 x 0.83: 1 -1.15,0; 2 1.15,0
USB-B-PTH = drill 0.914 pad 1.676: D+ 0,1.25; D- 1.981,1.25; GND 0,-1.25; VBUS 1.981,-1.25 | drill 2.286: S1 -2.718,-6.02; S2 -2.718,6.02
DC-21MM = drill 3.302 pad 4.826 octagon: 1 -5.08,-3.353; 2 -0.076,-6.35; 3 -0.076,-0.356
B6B-ZR = drill 0.7: 1 9,-1.3; 2 7.5,-1.3; 3 6,-1.3; 4 4.5,-1.3; 5 3,-1.3; 6 1.5,-1.3
KICKER = smd 2.54 x 5.08: 1 14.2,18.5; 2 17.7,18.5 | hole 3: 7,7.5; 22,7.5
IND_IHLP_2525_CZ_VIS-M = smd 2.625 x 3.429: 1 -2.557,0; 2 2.557,0
WS2812B = smd 1.5 x 0.9: 1-VDD 2.45,-1.65; 2-DOUT 2.45,1.65; 3-GND -2.45,1.65; 4-DIN -2.45,-1.65
SOT23-6 = smd 0.6 x 0.9: 1 -0.95,-1.15; 2 0,-1.15; 3 0.95,-1.15; 4 0.95,1.15; 5 0,1.15; 6 -0.95,1.15
SOT-23 = smd 1 x 1.4: 1 -0.95,-1.1; 2 0.95,-1.1; 3 0,1.1
TO252 = smd 1 x 1.6: 1 -2.28,-4.8; 2 2.28,-4.8 | smd 5.4 x 6.2: 3 0,2.5
R2010 = smd 1.8 x 2.7: 1 -2.2,0; 2 2.2,0
TRACOPOWER = drill 0.8 square: P$1 3.5,2; P$2 6.04,2; P$3 8.58,2
L202021MA04Q = drill 2.032 square: P1 6.909,-4.597; P2 6.909,0; P3 6.909,4.597; P4 0,-4.597; P5 0,0; P6 0,4.597
SSOP28 = smd 0.4 x 1.5: 1 -4.225,-3.625; 2 -3.575,-3.625; 3 -2.925,-3.625; 4 -2.275,-3.625; 5 -1.625,-3.625; 6 -0.975,-3.625; 7 -0.325,-3.625; 8 0.325,-3.625; 9 0.975,-3.625; 10 1.625,-3.625; 11 2.275,-3.625; 12 2.925,-3.625; 13 3.575,-3.625; 14 4.225,-3.625; 15 4.225,3.625; 16 3.575,3.625; 17 2.925,3.625; 18 2.275,3.625; 19 1.625,3.625; 20 0.975,3.625; 21 0.325,3.625; 22 -0.325,3.625; 23 -0.975,3.625; 24 -1.625,3.625; 25 -2.275,3.625; 26 -2.925,3.625; 27 -3.575,3.625; 28 -4.225,3.625
MODULE_ESP32-WROOM-32E_(16MB) = smd 2 x 0.9: 1 -8.5,5.26; 2 -8.5,3.99; 3 -8.5,2.72; 4 -8.5,1.45; 5 -8.5,0.18; 6 -8.5,-1.09; 7 -8.5,-2.36; 8 -8.5,-3.63; 9 -8.5,-4.9; 10 -8.5,-6.17; 11 -8.5,-7.44; 12 -8.5,-8.71; 13 -8.5,-9.98; 14 -8.5,-11.25; 25 8.5,-11.25; 26 8.5,-9.98; 27 8.5,-8.71; 28 8.5,-7.44; 29 8.5,-6.17; 30 8.5,-4.9; 31 8.5,-3.63; 32 8.5,-2.36; 33 8.5,-1.09; 34 8.5,0.18; 35 8.5,1.45; 36 8.5,2.72; 37 8.5,3.99; 38 8.5,5.26 | smd 0.9 x 2: 15 -5.715,-12.25; 16 -4.445,-12.25; 17 -3.175,-12.25; 18 -1.905,-12.25; 19 -0.635,-12.25; 20 0.635,-12.25; 21 1.905,-12.25; 22 3.175,-12.25; 23 4.445,-12.25; 24 5.715,-12.25 | smd 1.33 x 1.33: 39_1 -2.835,-0.405; 39_2 -1,-0.405; 39_3 0.835,-0.405; 39_4 -2.835,-2.24; 39_5 -1,-2.24; 39_6 0.835,-2.24; 39_7 -2.835,-4.075; 39_8 -1,-4.075; 39_9 0.835,-4.075 | drill 0.2 pad 0.3: 39_10 -1.917,-0.405; 39_11 -0.083,-0.405; 39_12 -2.835,-1.323; 39_13 -1,-1.323; 39_14 0.835,-1.323; 39_15 -1.917,-2.24; 39_16 -0.083,-2.24; 39_17 -2.835,-3.158; 39_18 -1,-3.158; 39_19 0.835,-3.158; 39_20 -1.917,-4.075; 39_21 -0.083,-4.075
SO8 = smd 1.981 x 0.533: 1 -2.464,1.905; 2 -2.464,0.635; 3 -2.464,-0.635; 4 -2.464,-1.905; 5 2.464,-1.905; 6 2.464,-0.635; 7 2.464,0.635; 8 2.464,1.905
SOT95P280X145-6N = smd 1.37 x 0.59: 1 -1.17,0.95; 2 -1.17,0; 3 -1.17,-0.95; 4 1.17,-0.95; 5 1.17,0; 6 1.17,0.95
STAND-OFF = hole 3.302: 0,0
SOT223 = smd 1.219 x 2.235: 1 -2.311,-3.099; 2 0,-3.099; 3 2.311,-3.099 | smd 7 x 6: 4 0,3.099

### Placement (x,y rotation side)
B1  78.41,72.24 90 top
C1  65.72,35.32 300 top
C2  122.24,77.47 60 top
C3  64.7,106.66 180 top
C4  148.16,39.68 240 top
C5  22.72,39.84 120 top
C6  84.25,144.76 0 top
C7  106.99,92.94 90 top
C8  109.27,92.81 270 top
C9  101.4,43.54 180 top
C10  91.65,23.32 0 top
C11  91.65,17.73 0 top
C12  102.01,14.1 270 top
C13  87.94,72.77 0 top
C14  87.96,74.88 0 top
C15  52.86,79.27 120 top
C16  45.11,84.51 30 top
C19  38.6,119.41 240 top
C20  21.71,91.19 60 top
D1  38.86,80.49 300 top
D3  82.53,23.01 0 top
J1  82.48,17.76 90 top
J2  115.36,105.18 300 top
J3  70.78,43.65 210 top
J4  120.11,75.11 330 top
J5  67.49,103.03 90 top
J6  21.38,101.43 330 top
L1  42.89,73.95 300 top
LED1  151.69,37.44 60 top
LED2  151.69,37.44 120 bottom
LED3  18.72,38.2 300 top
LED4  18.72,38.2 240 bottom
LED5  84.38,148.82 180 top
LED6  84.38,148.82 0 bottom
Q1  108.26,88.62 0 top
Q2  104.57,88.62 0 top
Q3  79.68,63.48 0 top
Q4  56.43,103.45 60 top
Q5  99.09,14.22 0 top
Q6  94.9,14.22 0 top
R1  98.96,17.91 270 top
R2  46.4,81.27 210 top
R3  106.61,82.14 0 top
R4  42.71,81.39 210 top
R5  102.92,82.14 0 top
R6  62.41,97.64 180 top
R7  111.81,92.81 90 top
R8  81.08,59.28 0 top
R9  103.56,93.96 0 top
R10  101.53,88.75 270 top
R11  110.29,85.19 180 top
R12  91.65,21.54 0 top
R13  91.65,19.63 0 top
R14  35.39,86.61 300 top
R15  94.9,17.91 90 top
R16  97.18,10.8 0 top
R17  97.18,8.76 180 top
REG1  83.97,76.56 0 top
S1  120.7,90.91 30 top
U1  101.53,36.93 270 top
U2  84.66,38.2 180 top
U3  111.94,88.62 0 top
U4  69.39,37.69 300 top
U5  126.81,76.46 60 top
U6  62.16,110.59 180 top
U7  49.64,77.32 300 top
U$2  [STAND-OFF]  39.04,8.61 45 top
U$3  [STAND-OFF]  62.16,6.45 45 top
U$4  [STAND-OFF]  108.13,6.58 45 top
U$5  [STAND-OFF]  131.24,8.61 45 top
U$6  [STAND-OFF]  164.52,66.14 45 top
U$8  [STAND-OFF]  154.61,87.1 45 top
U$9  [STAND-OFF]  131.75,126.98 45 top
U$10  [STAND-OFF]  118.54,145.77 45 top
U$11  [STAND-OFF]  51.87,145.77 45 top
U$15  [STAND-OFF]  5.89,66.27 45 top
U$25  89.08,67.23 180 top
U$31  [STAND-OFF]  51.36,65.51 45 top
U$33  [STAND-OFF]  61.52,48.36 45 top
U$35  [STAND-OFF]  118.67,65.51 45 top
U$36  [STAND-OFF]  109.15,48.36 45 top
U$38  [STAND-OFF]  75.49,106.78 45 top
U$39  [STAND-OFF]  95.18,106.78 45 top

### Tracks (layer width: path | path; a pad name or v marks a point on that pad's centre or on a via)
3.3V  (via drill 0.3)
  Top 0.203: R1.1 98.92,18.86 94.92,18.86 R15.2 95.32,18.96 v95.32,19.86 | v95.22,32.86 93.92,34.16 93.22,34.16 U2.2 | 80.67,73.21 78.42,75.46 B1.P$2 | 80.67,73.21 83.52,70.36 86.72,70.36 U$25.3 | 80.67,73.21 77.32,69.86 77.32,58.56 63.72,44.96 63.72,41.06 J3.2 | v78.82,32.86 v82.32,32.86
  Top 0.406: 86.72,70.36 87.04,70.36 C13.1 87.06,72.77 C14.1
  Bottom 0.203: v95.32,19.86 95.22,19.96 v95.22,32.86 v82.32,32.86 | J5.2 68.82,110.46 69.92,109.36 69.92,83.96 78.32,75.56 B1.P$2 78.52,75.56 86.92,83.96 93.12,83.96 94.72,82.36 94.72,77.56 102.82,69.46 124.42,69.46 125.12,70.16 125.92,70.16 J4.2 | v78.82,32.86 71.82,32.86 63.72,40.96 J3.2
BUZZER  (via drill 0.3)
  Top 0.203: v89.22,52.06 82.02,59.26 R8.2 | v91.52,49.76 91.52,42.86 92.52,41.86 93.12,41.86 U2.8
  Bottom 0.203: v91.52,49.76 v89.22,52.06
DTR  (via drill 0.3)
  Top 0.203: R16.1 96.22,10.86 96.22,12.76 95.92,13.06 Q6.2 95.92,13.16 95.92,16.26 97.42,17.76 99.72,17.76 99.82,17.66 v100.12,17.66 | v96.52,40.46 97.82,40.46 U1.2
  Bottom 0.203: v96.52,40.46 96.52,40.06 97.22,39.36 97.22,20.56 v100.12,17.66
EN  (via drill 0.3)
  Top 0.203: C12.1 101.92,15.06 99.32,15.06 99.12,15.26 Q5.3 99.02,15.36 99.02,16.96 R1.2 98.92,16.96 v97.62,16.96 | v95.32,33.96 93.82,35.46 93.22,35.46 U2.3
  Bottom 0.203: v95.32,33.96 95.32,33.76 96.22,32.86 96.22,18.36 v97.62,16.96
GND  (via drill 0.3, 0.6)
  Top 0.406: U1.7 100.52,37.26 101.4,37.26 101.94,36.72 | 101.94,36.72 102.05,36.61 102.36,36.61 | 102.36,36.61 U1.21 | U1.18 101.94,34.66 101.94,36.72 | U1.25 v102.36,39.21 102.36,36.61
  Top 0.508: 125.47,78.61 126.32,79.46 U5.8 | 125.47,78.61 125.12,78.26 122.72,78.26 C2.2 | 125.47,78.61 127.32,76.76 128.52,76.76 129.32,77.56 129.62,77.56 U5.5 | J4.5 122.12,72.56 122.12,75.26 123.02,76.16 123.02,78.06 C2.2 | 106.67,86.71 108.12,85.26 109.32,85.26 R11.2 109.62,85.06 116.32,78.36 122.52,78.36 C2.2 | 106.67,86.71 106.52,86.86 106.52,88.86 105.62,89.76 Q2.4 | 106.67,86.71 102.12,82.16 R5.1 101.82,82.06 98.12,82.06 93.42,77.36 89.92,77.36 | U$25.2 89.12,70.26 87.52,68.66 85.82,68.66 80.72,63.56 80.72,62.46 Q3.2 80.82,62.26 90.22,52.86 90.22,50.66 U2.15 90.32,50.36 90.32,45.16 87.62,42.46 U2.39_7 | U$25.2 88.92,70.46 88.92,72.56 C13.2 88.92,72.86 88.92,74.86 C14.2 89.02,75.06 89.92,75.96 89.92,77.36 | 89.12,70.36 U$25.2 | 89.92,77.36 89.92,78.46 REG1.P$2 | C1.2 66.22,34.56 68.92,34.56 U4.5 69.22,34.56 70.12,33.66 74.22,33.66 74.37,33.81 | 74.37,33.81 75.22,32.96 76.12,32.96 U2.38 76.42,32.96 77.72,32.96 83.62,38.86 U2.39_3 | 74.37,33.81 72.32,35.86 72.32,36.46 U4.8 72.22,36.76 72.22,38.96 71.02,40.16 71.02,41.06 69.72,42.36 68.82,42.36 67.92,43.26 67.62,43.26 J3.5 | U2.39_7 87.42,42.26 86.62,42.26 U2.39_20 86.32,42.26 85.92,42.26 U2.39_8 85.62,42.26 84.92,42.26 U2.39_21 84.72,42.26 83.92,42.26 U2.39_9 | C9.2 100.52,43.46 100.52,37.46 100.52,37.26 | U1.26 105.12,39.76 105.12,39.36 U1.25 | U2.39_3 83.82,38.66 83.82,39.46 U2.39_14 83.82,39.76 83.82,40.36 U2.39_6 83.82,40.66 83.82,41.26 U2.39_19 | U2.39_2 85.72,38.66 85.72,39.46 U2.39_13 85.72,39.76 85.72,40.36 U2.39_5 | U2.39_2 85.42,38.66 84.82,38.66 U2.39_11 84.52,38.66 84.02,38.66 U2.39_3
  Top 0.508: U2.39_2 85.92,38.66 86.52,38.66 U2.39_10 86.72,38.46 87.02,38.16 | U2.39_16 84.82,40.46 85.42,40.46 U2.39_5 | U2.39_18 85.62,41.26 85.62,40.66 U2.39_5 | U2.39_15 86.52,40.46 85.92,40.46 U2.39_5 | 87.02,38.16 92.22,32.96 93.12,32.96 U2.1 93.32,32.76 94.22,31.86 | 87.02,38.16 87.32,38.46 U2.39_1 87.52,38.66 87.52,39.46 U2.39_12 87.52,39.76 87.52,40.36 U2.39_4 87.52,40.66 87.52,41.26 U2.39_17 87.42,41.56 87.42,42.06 U2.39_7 | 94.22,31.86 99.12,31.86 101.82,34.56 101.94,34.66 | C4.2 147.72,38.86 147.72,37.46 149.02,36.16 LED1.3-GND 149.22,36.06 v150.72,34.56 150.62,34.36 150.62,32.86 124.52,6.76 112.46,7.65 105.2,13.67 102.22,13.06 C12.2 101.92,13.16 101.12,12.36 v101.12,12.26 | 89.82,17.76 83.82,17.76 J1.GND | 89.82,17.76 90.72,17.76 C11.1 | 89.82,17.76 89.82,22.36 90.72,23.26 C10.1 90.92,23.46 91.92,24.46 93.12,24.46 94.12,25.46 94.12,31.66 94.22,31.86 | 49.02,78.36 U7.2 48.92,78.56 48.92,78.96 47.97,79.91 | 47.97,79.91 47.12,80.76 47.12,81.46 R2.1 47.12,81.76 47.12,83.66 45.92,84.86 C16.2 45.92,85.16 48.35,93.67 49.32,98.06 v49.71,99.29 | C15.2 52.42,80.06 48.12,80.06 47.97,79.91 | C5.2 22.22,40.66 19.42,40.66 19.02,41.06 LED3.3-GND 18.72,41.06 v17.22,39.56 | C6.2 85.22,144.76 85.22,145.56 86.82,147.16 LED5.3-GND 86.82,147.36 v86.82,148.26 | 63.72,104.86 63.72,103.26 63.09,102.21 | 63.72,104.86 63.72,106.56 C3.2 | 61.07,107.31 63.52,104.86 63.72,104.86 | 61.07,107.31 59.72,108.66 U6.8 | U6.5 59.72,112.46 60.42,112.46 61.22,111.66 61.22,107.46 61.07,107.31 | J5.5 68.72,105.96 65.02,102.26 v63.93,101.7 63.32,100.66 63.32,97.66 R6.1 63.52,97.56 83.72,77.36 89.92,77.36
  Top 0.508: v37.12,117.26 C19.-
  Top 2.184: 38.15,105.39 v37.12,117.26
  Top 2.54: C20.- 33.07,97 38.15,105.39 v49.71,99.29 | Q4.2 63.09,102.21 v63.93,101.7
  Bottom 0.406: v102.36,39.21 102.34,39.21 102.34,39.19
  Bottom 0.508: v150.72,34.56 151.82,34.56 LED2.3-GND | v101.12,12.26 88.22,12.26 83.82,16.66 83.82,17.66 J1.GND | v17.22,39.56 16.12,39.56 LED4.3-GND 16.02,39.76 13.12,56.31 10.02,65 8.12,70.93 8.02,71.36 8.02,79.26 22.12,93.36 22.92,93.36 C20.- | v86.82,148.26 86.82,149.16 | 86.82,149.16 86.82,150.46 LED6.3-GND | 86.82,149.16 60.65,149.19 53.55,142.09 47.52,142.06 37.12,131.66 v37.12,117.26
  Bottom 2.54: v63.93,101.7 v49.71,99.29
  other vias: 78.16,86.74 93.35,94.82 73.36,72.26 73.76,62.89
  pour Bottom: 2.85,173.63 185.85,173.63 185.85,-10.64 -38.22,-10.64 -38.22,110.34
  pour Top: 0.18,170.97 182.37,170.97 182.37,-9.55 -44.88,-9.55 -44.88,114.1
GND_RAW  (via drill 0.3)
  Top 0.508: 110.42,89.86 110.92,89.86 U3.6 | 110.42,89.86 109.22,89.86 Q1.4 | 108.12,92.56 108.12,91.46 107.82,91.16 103.52,91.16 102.82,90.46 102.82,89.26 101.62,88.06 101.62,87.86 R10.2 | 108.12,92.56 109.22,93.66 C8.1 109.42,93.56 110.42,92.56 110.42,92.46 | C7.2 107.02,93.76 108.02,92.76 108.12,92.56 | 110.42,92.46 110.42,89.86 | v110.62,92.46 110.42,92.46
  Bottom 0.508: 115.57,92.61 115.02,93.16 J2.3 | 115.57,92.61 121.22,86.96 122.92,86.96 S1.P4 | v110.62,92.46 115.42,92.46 115.57,92.61
IO0  (via drill 0.3)
  Top 0.203: 94.92,16.56 94.92,15.36 Q6.3 | 94.92,16.56 94.92,16.96 R15.1 | v92.02,16.56 94.92,16.56 | v70.02,49.36 76.12,49.36 U2.25
  Bottom 0.203: v92.02,16.56 90.42,16.56 82.62,24.36 76.82,24.36 61.32,39.86 61.32,40.66 v70.02,49.36
KICK  (via drill 0.3)
  Top 0.203: Q4.1 59.52,99.06 60.92,97.66 61.42,97.66 R6.2 61.52,97.56 70.12,88.96 v70.12,81.86 | v82.32,63.96 97.52,48.76 97.52,46.36 94.32,43.16 93.22,43.16 U2.9
  Bottom 0.203: v82.32,63.96 82.32,69.66 v70.12,81.86
KICKER
  Top 2.54: J6.2 Q4.3
LEDS  (via drill 0.3)
  Top 0.203: v115.38,6.01 124.42,5.86 151.82,33.26 151.82,34.46 LED1.4-DIN | v94.82,46.66 93.42,46.66 93.22,46.86 U2.12
  Bottom 0.203: v115.38,6.01 100.22,18.56 100.12,18.56 97.72,20.96 97.72,43.76 v94.82,46.66
M1A  (via drill 0.3)
  Top 0.203: v70.12,37.66 70.12,35.26 U4.6 | v80.52,45.56 84.02,49.06 88.42,49.06 89.02,49.66 89.02,50.36 U2.16
  Bottom 0.203: v70.12,37.66 78.02,45.56 v80.52,45.56
M1B  (via drill 0.3)
  Top 0.203: v71.22,37.76 71.22,35.96 U4.7 | v85.12,47.66 v80.52,43.06 | v94.82,47.66 94.32,47.66 93.82,48.16 93.22,48.16 U2.13
  Bottom 0.203: v71.22,37.76 75.22,37.76 v80.52,43.06 | v94.82,47.66 v85.12,47.66
M1C1
  Top 0.203: U2.26 76.12,48.16 71.02,48.16 66.32,43.46 66.32,42.56 J3.4
M1C2  (via drill 0.3)
  Top 0.203: v70.82,46.96 76.12,46.96 U2.27
  Bottom 0.203: v70.82,46.96 69.22,46.96 65.02,42.76 65.02,41.86 J3.3
M1P1  (via drill 0.3)
  Top 0.508: v70.52,39.36 69.82,40.06 69.82,40.76 U4.1
  Bottom 0.508: v70.52,39.36 70.52,42.36 68.92,43.96 J3.6
M1P2
  Top 0.508: U4.4 66.42,38.96 63.72,38.96 62.42,40.26 J3.1
M2A  (via drill 0.3)
  Top 0.203: v68.72,93.56 86.02,110.86 116.02,110.86 131.42,95.46 131.42,89.66 128.62,86.86 128.62,78.36 U5.6 | v74.52,46.26 74.92,46.26 75.52,45.66 76.12,45.66 U2.28
  Bottom 0.203: v68.72,93.56 68.72,52.26 74.52,46.46 v74.52,46.26
M2B  (via drill 0.3)
  Top 0.203: v127.52,80.76 127.52,78.96 U5.7 | v104.52,68.76 v106.42,70.66 | v78.52,44.56 v82.32,48.36 | v77.82,43.26 76.32,43.26 76.22,43.16 U2.30
  Bottom 0.203: v127.52,80.76 116.52,80.76 v106.42,70.66 | v104.52,68.76 102.72,68.76 v82.32,48.36 | v78.52,44.56 78.52,43.96 v77.82,43.26
M2C1  (via drill 0.3)
  Top 0.203: v77.82,41.86 76.22,41.86 U2.31 | v84.32,48.36 v80.52,44.56 | v114.62,68.06 115.02,68.06 118.42,71.46 123.12,71.46 123.32,71.66 J4.4
  Bottom 0.203: v80.52,44.56 v77.82,41.86 | v84.32,48.36 84.32,49.16 103.22,68.06 v114.62,68.06
M2C2  (via drill 0.3)
  Top 0.203: v74.52,44.86 74.52,40.26 75.42,39.36 76.12,39.36 U2.33 | v88.22,52.06 v80.52,52.06 | v114.62,67.06 118.22,70.66 124.32,70.66 124.62,70.96 J4.3
  Bottom 0.203: v74.52,44.86 80.52,50.86 v80.52,52.06 | v88.22,52.06 103.22,67.06 v114.62,67.06
M2P1  (via drill 0.3)
  Top 0.508: v123.92,76.86 123.92,75.36 U5.1
  Bottom 0.508: v123.92,76.86 121.32,76.86 120.52,76.06 120.52,73.46 120.72,73.26 J4.6
M2P2
  Top 0.508: U5.4 127.32,73.36 127.32,69.56 J4.1
M3A  (via drill 0.3)
  Top 0.203: v58.12,111.16 59.62,111.16 U6.6 | v77.82,49.16 77.82,44.26 78.52,43.56 v78.52,40.06 | v78.52,37.16 76.92,35.56 76.22,35.56 U2.36
  Bottom 0.203: v58.12,111.16 61.52,111.16 64.02,108.66 64.02,103.96 69.42,98.56 69.42,57.56 v77.82,49.16 | v78.52,37.16 v78.52,40.06
M3B  (via drill 0.3)
  Top 0.203: v61.12,98.86 60.12,99.86 60.12,103.76 60.62,104.26 60.62,106.86 60.22,107.26 59.42,107.26 58.32,108.36 58.32,109.06 59.12,109.86 59.62,109.86 U6.7 | v71.92,40.56 71.92,40.16 74.82,37.26 74.82,34.86 75.42,34.26 76.12,34.26 U2.37
  Bottom 0.203: v61.12,98.86 61.12,59.26 71.92,48.46 v71.92,40.56
M3C1  (via drill 0.3)
  Top 0.203: v96.82,46.66 94.62,44.46 93.22,44.46 U2.10 | v96.82,79.56 v96.82,57.36 | v75.82,102.46 73.82,102.46 68.82,107.46 J5.4
  Bottom 0.203: v96.82,57.36 v96.82,46.66 | v96.82,79.56 96.82,81.46 v75.82,102.46
M3C2  (via drill 0.3)
  Top 0.203: v95.82,46.66 94.82,45.66 93.22,45.66 U2.11 | v95.82,78.56 v95.82,57.36
  Bottom 0.203: v95.82,57.36 v95.82,46.66 | v95.82,78.56 95.82,81.86 75.92,101.76 74.82,101.76 70.42,106.16 70.42,111.76 69.22,112.96 68.42,112.96 67.82,112.36 67.82,109.96 68.72,109.06 J5.3
M3P1  (via drill 0.3)
  Top 0.508: v64.72,107.86 64.72,108.66 U6.1
  Bottom 0.508: v64.72,107.86 65.42,107.86 68.72,104.56 J5.6
M3P2
  Top 0.508: U6.4 64.72,112.46 68.32,112.46 68.72,112.06 J5.1
N$1
  Top 0.203: U7.1 49.92,78.76 49.92,78.06 50.02,77.96 50.02,77.76 49.02,76.76 42.12,76.76 L1.1
  Top 1.676: L1.1 D1.2
N$2
  Top 0.203: 41.12,80.96 39.62,80.96 38.52,82.06 D1.1 | 41.12,80.96 41.92,80.96 R4.2 | C16.1 44.32,84.06 44.12,84.06 41.12,81.06 41.12,80.96
  Top 1.676: D1.1 R14.2
N$3
  Top 0.203: R8.1 80.12,59.36 80.12,61.06 78.82,62.36 Q3.1
N$4
  Top 0.203: R4.1 43.52,81.76 44.42,80.86 45.62,80.86 R2.2 45.32,80.76 48.22,77.86 U7.3
N$5
  Top 0.203: Q3.3 79.62,64.66 79.62,67.66 78.42,68.86 B1.P$1
N$6  (via drill 0.3)
  Top 0.203: v95.42,41.16 97.82,41.16 U1.1 | v82.42,42.96 77.52,38.06 76.22,38.06 U2.34
  Bottom 0.203: v95.42,41.16 88.72,41.16 86.92,42.96 v82.42,42.96
N$7
  Top 0.508: S1.P2 126.72,94.36 126.72,97.26 127.02,97.56 127.02,99.06 124.12,101.96 110.02,101.96 109.92,102.06 J2.2
N$8  (via drill 0.3)
  Top 0.203: 111.92,90.86 111.92,91.76 111.82,91.86 R7.1 | 111.92,90.86 111.92,89.86 U3.5 | v109.32,90.86 109.32,91.86 C8.2 | v111.82,90.86 111.92,90.86
  Bottom 0.203: v111.82,90.86 v109.32,90.86
N$9
  Top 0.203: U3.4 112.82,89.86 112.82,92.36 112.22,92.96 111.12,92.96 110.22,93.86 110.22,94.26 109.92,94.56 105.12,94.56 104.52,93.96 R9.2 | R10.1 101.62,89.66 101.62,91.06 104.42,93.86 R9.2 | C7.1 106.92,92.06 104.82,94.16 R9.2
N$10
  Top 0.203: 104.12,87.56 104.52,87.56 Q2.2 | 104.12,87.56 103.72,87.56 Q2.1 | 104.12,89.86 104.52,89.86 Q2.5 104.52,89.96 105.12,90.56 106.52,90.56 Q1.6 107.32,89.86 107.82,89.86 | 104.12,89.86 103.72,89.86 Q2.6 | 104.12,89.86 104.12,87.56 | 107.82,87.56 108.22,87.56 Q1.2 | 107.82,87.56 107.32,87.56 Q1.1 | 107.82,89.86 108.22,89.86 Q1.5 | 107.82,89.86 107.82,87.56
N$11  (via drill 0.3)
  Top 0.203: v105.62,88.56 105.62,87.56 Q2.3 | v111.12,88.56 111.92,87.76 111.92,87.56 U3.2
  Bottom 0.203: v111.12,88.56 v105.62,88.56
N$12
  Top 0.203: Q1.3 109.22,87.56 110.92,87.56 U3.1
N$13
  Top 0.203: R11.1 111.22,85.26 112.82,86.86 112.82,87.46 U3.3 112.92,87.56 117.32,87.56 120.62,90.86 S1.P5
N$14  (via drill 0.3)
  Top 0.203: v94.82,38.46 97.82,38.46 U1.5 | v82.32,38.76 78.82,38.76 76.82,36.76 76.22,36.76 U2.35
  Bottom 0.203: v94.82,38.46 87.42,38.46 86.82,37.86 83.22,37.86 v82.32,38.76
N$15  (via drill 0.3)
  Top 0.203: 98.72,39.26 99.02,39.56 99.02,43.56 99.92,44.46 101.02,44.46 101.92,43.56 102.22,43.56 C9.1 | 98.72,39.26 97.92,39.26 U1.4 | v103.82,33.86 103.92,33.96 105.12,33.96 U1.17 | v99.22,38.46 99.22,38.66 98.72,39.16 98.72,39.26
  Bottom 0.203: v99.22,38.46 v103.82,33.86
N$16
  Top 0.203: R16.2 98.12,10.86 98.12,13.06 Q5.1
N$17
  Top 0.203: R17.2 96.22,8.86 96.22,9.36 94.02,11.56 94.02,13.06 Q6.1
N$27  (via drill 0.3)
  Top 0.203: v149.12,38.06 151.42,40.36 LED1.2-DOUT
  Bottom 0.203: v149.12,38.06 149.12,36.16 LED2.4-DIN
N$28  (via drill 0.3)
  Top 0.203: v16.12,36.26 16.12,39.46 LED3.4-DIN
  Bottom 0.203: 124.49,6.45 154.32,35.46 154.32,38.66 LED2.2-DOUT | v16.12,36.26 49.23,2.76
  Bottom 0.406: 49.23,2.76 63.93,2.76 67.11,5.94 103.51,5.94 106.48,2.97 121.99,2.97 124.49,6.45
N$30  (via drill 0.3)
  Top 0.203: v44.52,137.86 50.04,142.19 73.14,142.19 81.02,151.26 86.12,151.26 86.82,150.56 LED5.4-DIN
  Bottom 0.203: v44.52,137.86 44.44,120.64 30.16,108.95 26.2,102.72 4.15,77.36 1.99,66.48 3.34,62.28 8.02,46.16 18.52,35.66 LED4.2-DOUT
N$32  (via drill 0.3)
  Top 0.203: v82.02,148.26 82.02,147.26 LED5.2-DOUT
  Bottom 0.203: v82.02,148.26 85.82,148.26 86.82,147.26 LED6.4-DIN
N$39  (via drill 0.3)
  Top 0.203: v19.02,39.26 21.32,36.96 LED3.2-DOUT
  Bottom 0.203: v19.02,39.26 19.02,41.06 LED4.4-DIN
N$59  (via drill 0.3)
  Top 0.203: v91.62,20.56 91.62,20.66 90.82,21.46 R12.1 | v87.42,20.56 84.22,23.76 83.22,23.76 82.02,22.56 82.02,20.46 81.32,19.76 J1.D-
  Bottom 0.203: v87.42,20.56 v91.62,20.56
N$60
  Top 0.203: R13.1 90.82,19.56 90.82,19.16 91.52,18.46 91.52,17.06 91.22,16.76 89.62,16.76 89.32,17.06 84.72,17.06 84.22,16.56 82.42,16.56 81.32,17.66 J1.D+
RTS  (via drill 0.3)
  Top 0.203: R17.1 98.12,8.86 98.12,9.36 100.02,11.26 100.02,13.06 Q5.2 100.12,13.16 100.82,13.86 v100.82,14.36 | v96.42,39.16 97.02,39.76 97.82,39.76 U1.3
  Bottom 0.203: v96.42,39.16 96.42,34.16 96.72,33.86 96.72,18.86 100.82,14.76 v100.82,14.36
USBDM
  Top 0.203: C10.2 92.62,23.26 92.62,21.56 R12.2 92.72,21.76 104.22,33.26 105.12,33.26 U1.16
USBDP
  Top 0.203: C11.2 92.62,17.76 92.62,19.56 R13.2 92.62,19.66 105.12,32.16 105.12,32.66 U1.15
VCC  (via drill 0.3)
  Top 0.508: 21.72,35.26 23.12,36.66 23.12,38.96 C5.1 | 21.32,35.26 18.62,35.26 LED3.1-VDD | 21.32,35.26 21.72,35.26 | v21.32,35.46 21.32,35.26 | 150.67,41.21 151.22,41.76 152.02,41.76 154.32,39.46 154.32,38.76 LED1.1-VDD | 150.67,41.21 150.02,40.56 148.62,40.56 C4.1 | v150.72,41.16 150.67,41.21 | C6.1 83.32,144.76 v83.32,147.16 83.32,149.16 82.02,150.46 LED5.1-VDD | v81.42,25.06 81.42,23.06 D3.1 81.12,23.06 75.18,21.46 57.69,7.63 45.72,6.76 21.82,30.66 21.82,35.06 21.72,35.26 | v91.42,72.06 91.42,70.36 U$25.1 | v97.02,82.26 93.22,78.46 92.62,78.46 REG1.P$3
  Bottom 0.406: 124.37,112.61 125.42,113.66 | 163.43,74.08 163.43,75.73 158.42,80.75 153.02,80.75 122.71,111.06
  Bottom 0.508: v21.32,35.46 21.32,36.86 LED4.1-VDD | LED2.1-VDD 151.42,40.46 v150.72,41.16 150.82,41.36 150.82,50.56 159.8,62.98 163.43,74.08 | LED6.1-VDD 82.02,147.16 v83.32,147.16 83.52,147.06 85.02,147.06 90.02,142.06 121.72,142.06 125.42,138.36 125.42,113.66 | v81.42,25.06 81.42,61.86 91.52,71.96 | 91.52,71.96 92.52,72.96 92.52,78.46 REG1.P$3 | v91.42,72.06 91.52,71.96 | 124.37,112.61 122.82,111.06 122.71,111.06 108.62,111.06 97.02,99.46 v97.02,82.26
VIN  (via drill 0.3, 0.6)
  Top 0.406: R3.2 109.98,82.14 v109.98,82.12 | v114.71,89.59 114.71,92.25 113.25,93.71 R7.2
  Top 0.508: v121.42,75.76 121.72,76.06 121.72,76.66 C2.1 | v123.42,73.76 124.22,73.76 125.02,74.56 U5.2 124.82,74.06 126.12,74.06 U5.3 | REG1.P$1 87.52,78.56 87.52,80.76 100.62,93.86 102.42,93.86 R9.1 102.72,93.96 103.92,95.16 110.32,95.16 111.72,93.76 R7.2 112.02,93.86 116.42,98.26 124.32,98.26 S1.P3 | 68.62,39.56 68.62,40.06 U4.2 | 68.62,39.56 68.62,38.76 66.02,36.16 65.32,36.16 C1.1 65.02,36.16 64.82,36.16 56.62,44.36 56.62,70.46 51.72,75.36 51.62,75.56 | 68.62,39.56 67.62,39.56 U4.3 | 65.32,110.56 64.72,111.16 U6.3 | 65.32,110.56 66.12,109.76 66.12,108.26 65.62,107.76 65.62,106.66 C3.1 | 65.32,110.56 64.72,109.96 U6.2 64.42,109.86 63.82,109.86 v62.72,108.76 | U7.5 50.22,76.26 49.82,75.86 49.42,75.86 U7.4 49.42,75.56 | 51.62,75.56 53.22,77.16 53.22,78.46 C15.1 | 49.42,75.56 51.62,75.56 | L1.2 44.22,71.76 45.52,71.76 49.22,75.46 49.42,75.56 | v58.32,104.36 58.32,99.66 53.92,95.26 53.92,79.06 53.52,78.66 C15.1 | v81.92,77.96 53.42,77.96 C15.1
  Bottom 0.406: v109.98,82.12 114.71,82.12 v114.71,89.59
  Bottom 0.508: v123.42,73.76 122.77,74.41 | 122.77,74.41 v121.42,75.76 | 122.77,74.41 128.42,80.06 128.42,87.56 124.02,91.96 124.02,97.96 124.32,98.26 S1.P3 | v58.32,104.36 v62.72,108.76 | v81.92,77.96 82.42,78.46 87.42,78.46 REG1.P$1
VOLTAGE
  Top 0.203: R5.2 103.82,82.06 103.82,50.56 94.52,41.26 94.52,39.96 93.92,39.36 93.22,39.36 U2.6
  Top 0.406: R5.2 R3.1
VSTORE
  Top 2.184: C20.+ 19.05,94.23 33.17,119.3 C19.+ J6.1
  Top 2.54: R14.1 20.91,88.51 C20.+
VUSB  (via drill 0.3)
  Top 0.203: D3.2 83.72,22.96 83.72,19.76 J1.VBUS | v93.52,19.06 106.22,31.76 106.22,35.66 106.02,35.86 105.22,35.86 U1.20
  Bottom 0.203: v93.52,19.06 93.52,17.06 92.32,15.86 90.52,15.86 86.72,19.66 83.82,19.66 J1.VBUS

### Text on the board
tPlace: GND
tNames: Robot Soccer Kit rev0